# Altium schematic sheet CalibradorDePlacas.SchDoc
size A4
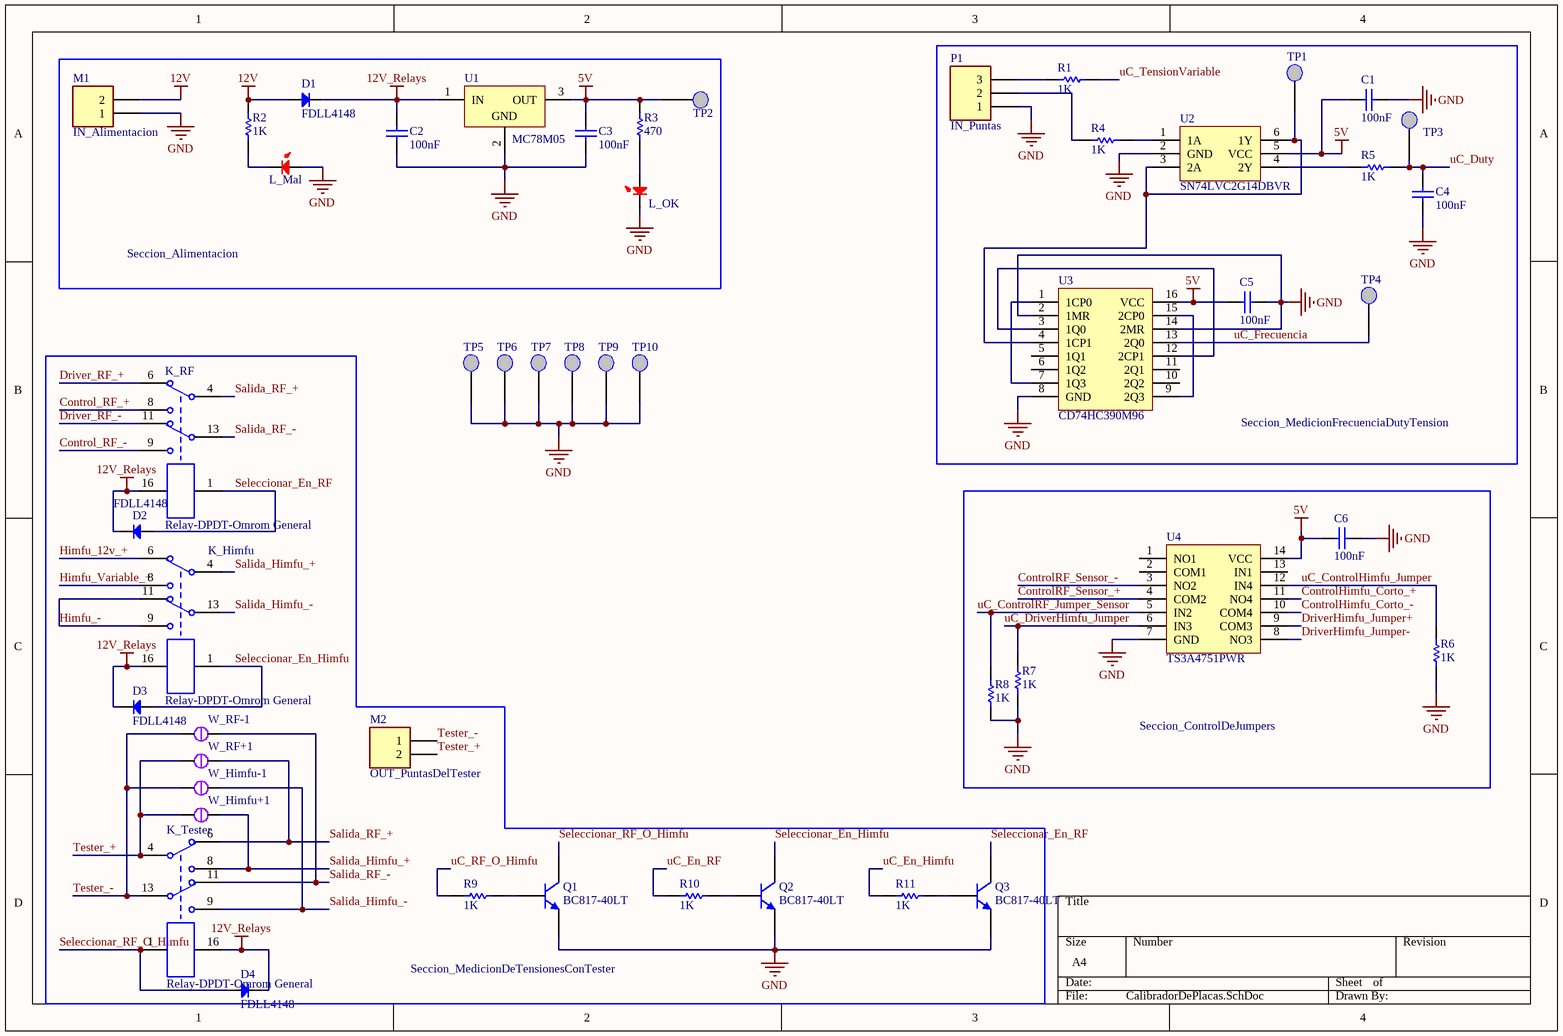
[diagram p0: CalibradorDePlacas.SchDoc]

## Parts
C1  100nF  [C_0805]
C2  100nF  [C_0805]
C3  100nF  [C_0805]
C4  100nF  [C_0805]
C5  100nF  [C_0805]
C6  100nF  [C_0805]
D1  FDLL4148  [SOD-80/MLL34]
D2  FDLL4148  [SOD-80/MLL34]
D3  FDLL4148  [SOD-80/MLL34]
D4  FDLL4148  [SOD-80/MLL34]
K_Himfu  Relay-DPDT-Omrom General  [RELAY_DPDT]
K_RF  Relay-DPDT-Omrom General  [RELAY_DPDT]
K_Tester  Relay-DPDT-Omrom General  [RELAY_DPDT]
L_Mal  PinesParaLed  [Jumper-Simple]  (value not drawn)
L_OK  PinesParaLed  [Jumper-Simple]  (value not drawn)
M1  IN_Alimentacion  [B2B-XH-A_3D]
M2  OUT_PuntasDelTester  [B2B-XH-A_3D]
P1  IN_Puntas  [B3B-XH-A_3D]
Q1  BC817-40LT  [SOT23]
Q2  BC817-40LT  [SOT23]
Q3  BC817-40LT  [SOT23]
R1  1K  [R_0805]
R2  1K  [R_0805]
R3  470  [R_0805]
R4  1K  [R_0805]
R5  1K  [R_0805]
R6  1K  [R_0805]
R7  1K  [R_0805]
R8  1K  [R_0805]
R9  1K  [R_0805]
R10  1K  [R_0805]
R11  1K  [R_0805]
TP1  IN_F  [TP-5002]  (value not drawn)
TP2  5V  [TP-5002]  (value not drawn)
TP3  OUT_D  [TP-5002]  (value not drawn)
TP4  OUT_F  [TP-5002]  (value not drawn)
TP5  GND  [TP-5002]  (value not drawn)
TP6  GND  [TP-5002]  (value not drawn)
TP7  GND  [TP-5002]  (value not drawn)
TP8  GND  [TP-5002]  (value not drawn)
TP9  GND  [TP-5002]  (value not drawn)
TP10  GND  [TP-5002]  (value not drawn)
U1  MC78M05  [TO-252AA_N]
U2  SN74LVC2G14DBVR  [SOT23-6]
U3  CD74HC390M96  [SOIC16]
U4  TS3A4751PWR  [TSSOP14]
W_Himfu+1  JMP  [SMD_JMP]  (value not drawn)
W_Himfu-1  JMP  [SMD_JMP]  (value not drawn)
W_RF+1  JMP  [SMD_JMP]  (value not drawn)
W_RF-1  JMP  [SMD_JMP]  (value not drawn)

## Blocks framed on the sheet
Seccion_Alimentacion: C2 C3 D1 L_Mal L_OK M1 R2 R3 TP2 U1
Seccion_MedicionFrecuenciaDutyTension: C1 C4 C5 P1 R1 R4 R5 TP1 TP3 TP4 U2 U3
Seccion_MedicionDeTensionesConTester: D2-D4 K_Himfu K_RF K_Tester M2 Q1-Q3 R9-R11 W_Himfu+1 W_Himfu-1 W_RF+1 W_RF-1
Seccion_ControlDeJumpers: C6 R6-R8 U4

## Nets
5V: C1.1 C3.2 C5.1 C6.1 R3.2 TP2.1 U1.3(OUT) U2.5(VCC) U3.16(VCC) U4.14(VCC)
12V: D1.1(A) M1.2 R2.2
12V_Relays: C2.2 D1.2(K) D2.2(K) D3.2(K) D4.2(K) K_Himfu.16(-) K_RF.16(-) K_Tester.16(-) U1.1(IN)
GND: C1.2 C2.1 C3.1 C4.1 C5.2 C6.2 L_Mal.1 L_OK.2 M1.1 P1.1 Q1.2(E) Q2.2(E) Q3.2(E) R6.1 R7.1 R8.1 TP5.1 TP6.1 TP7.1 TP8.1 TP9.1 TP10.1 U1.2(GND) U2.2(GND) U3.2(1MR) U3.8(GND) U3.14(2MR) U4.7(GND)
Control_RF_+: K_RF.8(NOb)
Control_RF_-: K_RF.9(NOa)
ControlHimfu_Corto_+: U4.11(NO4)
ControlHimfu_Corto_-: U4.10(COM4)
ControlRF_Sensor_+: U4.4(COM2)
ControlRF_Sensor_-: U4.3(NO2)
Driver_RF_+: K_RF.6(NCb)
Driver_RF_-: K_RF.11(NCa)
DriverHimfu_Jumper+: U4.9(COM3)
DriverHimfu_Jumper-: U4.8(NO3)
Himfu_12v_+: K_Himfu.6(NCb)
Himfu_-: K_Himfu.9(NOa) K_Himfu.11(NCa)
Himfu_Variable_+: K_Himfu.8(NOb)
Salida_Himfu_+: K_Himfu.4(Cb) K_Tester.8(NOb) W_Himfu+1.2
Salida_Himfu_-: K_Himfu.13(Ca) K_Tester.9(NOa) W_Himfu-1.2
Salida_RF_+: K_RF.4(Cb) K_Tester.6(NCb) W_RF+1.2
Salida_RF_-: K_RF.13(Ca) K_Tester.11(NCa) W_RF-1.2
Seleccionar_En_Himfu: D3.1(A) K_Himfu.1(+) Q2.3(C)
Seleccionar_En_RF: D2.1(A) K_RF.1(+) Q3.3(C)
Seleccionar_RF_O_Himfu: D4.1(A) K_Tester.1(+) Q1.3(C)
Tester_+: K_Tester.4(Cb) M2.2 W_Himfu+1.1 W_RF+1.1
Tester_-: K_Tester.13(Ca) M2.1 W_Himfu-1.1 W_RF-1.1
uC_ControlHimfu_Jumper: R6.2 U4.12(IN4)
uC_ControlRF_Jumper_Sensor: R8.2 U4.5(IN2)
uC_DriverHimfu_Jumper: R7.2 U4.6(IN3)
uC_Duty: C4.2 R5.2 TP3.1
uC_En_Himfu: R11.1
uC_En_RF: R10.1
uC_Frecuencia: TP4.1 U3.13(2Q0)
uC_RF_O_Himfu: R9.1
uC_TensionVariable: R1.2
NetL_Mal_2: L_Mal.2 R2.1
NetL_OK_1: L_OK.1 R3.1
NetP1_2: P1.2 R4.1
NetP1_3: P1.3 R1.1
NetQ1_1: Q1.1(B) R9.2
NetQ2_1: Q2.1(B) R10.2
NetQ3_1: Q3.1(B) R11.2
NetR4_2: R4.2 U2.1(1A)
NetR5_1: R5.1 U2.4(2Y)
NetTP1_1: TP1.1 U2.3(2A) U2.6(1Y) U3.4(1CP1)
NetU3_1: U3.1(1CP0) U3.7(1Q3)
NetU3_3: U3.3(1Q0) U3.12(2CP1)
NetU3_9: U3.9(2Q3) U3.15(2CP0)

Not connected (* = marked no-connect by the designer): U3 5(1Q1) 6(1Q2) 10(2Q2) 11(2Q1); U4 1(NO1) 2(COM1) 13(IN1)

## Library data of the parts
C1-C6 = C_100nF: CAP CER 0.1UF 25V X7R 0805; Note: Footprint corresponds to dimensions for bulk cassette packaging. This case size has tightened tolerances.; Cod.Fabricante: C0805C104M3RACTU; Fabricante: KEMET; Published: 17-Jul-2002; LatestRevisionDate: 19-Mar-2004; LatestRevisionNote: Silkscreen size reduced.; DatasheetDocument: Mar-2001; PackageDocument: Mar-2001; PackageReference: 0805; Publisher: Altium Limited; ComponentLink1Description: Manufacturer Link; ComponentLink1URL: http://www.kemet.com/; ComponentLink2Description: Datasheet; ComponentLink2URL: https://content.kemet.com/datasheets/KEM_C1002_X7R_SMD.pdf; Cod.Digikey: 399-8000-1-ND; Value: 100nF; DIGIKEYx100: 0.03160
D1-D4 = Diode FDLL4148: DIODE GEN PURP 100V 200MA LL34/SOD80/MINI MELF; Fabricante: ON Semiconductor; Published: 8-Jun-2000; LatestRevisionDate: 17-Jul-2002; LatestRevisionNote: Re-released for DXP Platform.; DatasheetDocument: 1998; PackageDocument: Aug-1999; PackageReference: MINI MELF; Publisher: Altium Limited; Code_JEDEC: MINI MELF; ComponentLink1Description: Manufacturer Link; ComponentLink1URL: https://www.fairchildsemi.com; ComponentLink2Description: Datasheet; ComponentLink2URL: https://www.fairchildsemi.com/datasheets/FD/FDLL4148.pdf; Value: FDLL4148; Cod.Digikey: FDLL4148CT-ND; Cod.Fabricante: FDLL4148; DIGIKEYx100: 0.0487
K_Himfu K_RF K_Tester = Relay-DPDT-Omrom General: RELAY GEN PURPOSE DPDT 1A 12VDC; Fabricante: Omron Electronics Inc-EMC Div; Cod.Fabricante: G5V-2-H1 DC12; Published: 24-Mar-1999; LatestRevisionDate: 17-Jul-2002; LatestRevisionNote: Re-released for DXP Platform.; PackageReference: DIP-P8; Publisher: Altium Limited; PackageDescription: Relay; 8 Leads; Cod.Digikey: Z109-ND; DIGIKEYx100: 2.38630
L_Mal L_OK = PinesParaLed: CONN HEADER 2 POS 2.54; Cod.Fabricante: 61300211121; Fabricante: Wurth Electronics Inc.; Cod.DigiKey: 732-5315-ND; ComponentLink1Description: Manufacturer Link; ComponentLink1URL: https://katalog.we-online.de/em/datasheet/6130xx11121.pdf; ComponentLink2Description: Datasheet; ComponentLink2URL: *; DatasheetVersion: *; DIGIKEYx100: 0.06700; LatestRevisionDate: *; LatestRevisionNote: *; PackageDescription: *; PackageReference: *; PackageVersion: *; Published: 29-sep-00; Publisher: Altium Limited; Value: *
M1 M2 = JST_2.5_2: CONN HEADER XH TOP 2POS 2.5MM; Cod.Fabricante: B2B-XH-A(LF)(SN); Fabricante: JST Sales America Inc.; LatestRevisionDate: 17-Jul-2002; LatestRevisionNote: Re-released for DXP Platform.; Publisher: Altium Limited; Cod.Digikey: 455-2247-ND; DIGIKEYx100: 0.0868; ComponentLink2URL: http://www.jst-mfg.com/product/pdf/eng/eXH.pdf; ComponentLink2Description: Datasheet
P1 = JST_2.5_3: CONN HEADER XH TOP 3POS 2.5MM; Cod.Fabricante: B3B-XH-A(LF)(SN); Fabricante: JST Sales America Inc.; LatestRevisionDate: 17-Jul-2002; LatestRevisionNote: Re-released for DXP Platform.; Publisher: Altium Limited; Cod.Digikey: 455-2248-ND; ComponentLink2Description: Datasheet; ComponentLink2URL: http://www.jst-mfg.com/product/pdf/eng/eXH.pdf; DIGIKEYx100: 0.1115
Q1-Q3 = BC817: TRANS NPN 45V 0.5A SOT23; Cod.Fabricante: BC817-40LT1G; Fabricante: ON Semiconductor; Published: 8-Jun-2000; LatestRevisionDate: 15-Jan-2003; LatestRevisionNote: PCB Footprint 'BCY-W3/D4.7' replaced; DatasheetVersion: 1997; PackageVersion: Sep-1998; PackageReference: SOT-23-3; Publisher: Altium Limited; PackageDescription: TO, Flat Index; 3 In-Line, Axial Leads; Body Dia. 4.5mm; Leads 0.51 x 0.48 mm (max); ComponentLink1Description: Manufacturer Link; ComponentLink1URL: http://www.onsemi.com/; ComponentLink2Description: Datasheet; ComponentLink2URL: http://www.onsemi.com/pub/Collateral/BC817-16LT1-D.PDF; Value: BC817-40LT; Cod.Digikey: BC817-40LT1GOSCT-ND; DIGIKEYx100: 0.08810
R1 R2 R4-R11 = R_1k: RES SMD 1K OHM 1% 1/8W 0805; Cod.Fabricante: RC0805FR-071KL; Fabricante: Yageo; Published: 8-Jun-2000; LatestRevisionDate: 17-Jul-2002; LatestRevisionNote: Re-released for DXP Platform.; PackageReference: 0805; Publisher: Altium Limited; Cod.Digikey: 311-1.00KCRCT-ND; Value: 1K; DIGIKEYx100: 0.01630
R3 = R_470: RES SMD 470 OHM 1% 1/8W 0805; Cod.Fabricante: RC0805FR-07470RL; Fabricante: Yageo; Published: 8-Jun-2000; LatestRevisionDate: 17-Jul-2002; LatestRevisionNote: Re-released for DXP Platform.; PackageReference: 0805; Publisher: Altium Limited; Cod.Digikey: 311-470CRCT-ND; Value: 470; DIGIKEYx100: 0.01630
TP1-TP10 = TestPoint: White PC Test Point, Miniature Phosphor Bronze, Silver Plating 0.040" (1.02mm) Hole Diameter Mounting Type; Cod.Fabricante: 5002; Fabricante: Keystone Electronics; Cod.DigiKey: 36-5002-ND; ComponentLink1Description: Manufacturer Link; ComponentLink1URL: http://www.keyelco.com/product-pdf.cfm?p=1311; ComponentLink2Description: Datasheet; ComponentLink2URL: *; DatasheetVersion: *; DIGIKEYx100: 0.22090; LatestRevisionDate: *; LatestRevisionNote: *; PackageDescription: *; PackageReference: *; PackageVersion: *; Published: 29-sep-00; Publisher: Altium Limited; Value: *
U1 = MC78M05: IC REG LINEAR 5V 500MA DPAK; Cod.Fabricante: MC78M05BDTRKG; Fabricante: ON Semiconductor; Published: 24-Aug-2001; LatestRevisionDate: 17-Jul-2002; LatestRevisionNote: Re-released for DXP Platform.; DatasheetVersion: Nov-1999; PackageReference: DPAK; Publisher: Altium Limited; PackageDescription: DPak (2 Leads + Tab); ComponentLink1Description: Manufacturer Link; ComponentLink1URL: http://www.onsemi.com; ComponentLink2Description: Datasheet; ComponentLink2URL: http://www.onsemi.com/pub/Collateral/MC78M00-D.PDF; Cod.Digikey: MC78M05BDTRKGOSCT-ND; DIGIKEYx100: 0.27660
U2 = SN74LVC2G14DBVR: IC INVERTER SCHMITT 2CH SOT23-6; Fabricante: Texas Instruments; Cod.DigiKey: 296-13010-1-ND; Cod.Fabricante: SN74LVC2G14DBVR; ComponentLink1Description: Manufacturer Link; ComponentLink1URL: http://www.ti.com/lit/ds/symlink/sn74lvc2g14.pdf; ComponentLink2Description: Datasheet; ComponentLink2URL: *; DatasheetVersion: O; DIGIKEYx100: 0.18240; LatestRevisionDate: *; LatestRevisionNote: *; PackageDescription: SOT-23-6; PackageReference: SOT-23-6; PackageVersion: *; Published: 29-sep-00; Publisher: Altium Limited; Value: SN74LVC2G14DBVR
U3 = CD74HC390M96: IC DUAL DECADE RPL COUNTR 16SOIC; Cod.DigiKey: 296-14526-1-ND; Cod.Fabricante: CD74HC390M96; ComponentLink1Description: Manufacturer Link; ComponentLink1URL: 0.43260; ComponentLink2Description: Datasheet; ComponentLink2URL: *; DatasheetVersion: *; DIGIKEYx100: 0.43260; Fabricante: *; LatestRevisionDate: *; LatestRevisionNote: *; PackageDescription: 16-SOIC (0.154", 3.90mm Width); PackageReference: 16-SOIC (0.154", 3.90mm Width); PackageVersion: *; Published: 29-sep-00; Publisher: Altium Limited; Value: CD74HC390M96
U4 = TS3A4751PWR: IC SWITCH QUAD SPST 14TSSOP; Fabricante: Texas Instruments; Cod.DigiKey: 296-20700-1-ND; Cod.Fabricante: TS3A4751PWR; ComponentLink1Description: Manufacturer Link; ComponentLink1URL: http://www.ti.com/lit/ds/symlink/ts3a4751.pdf; ComponentLink2Description: Datasheet; ComponentLink2URL: *; DatasheetVersion: F; DIGIKEYx100: 0.75680; LatestRevisionDate: *; LatestRevisionNote: *; PackageDescription: 14-TSSOP; PackageReference: 14-TSSOP; PackageVersion: *; Published: 29-sep-00; Publisher: Altium Limited; Value: TS3A4751PWR
W_Himfu+1 W_Himfu-1 W_RF+1 W_RF-1 = SMD_JMP: Islas para hacer un jumper con estaño